# EAGLE design SFT_MainBoard1.0v (EAGLE 7.2.0)
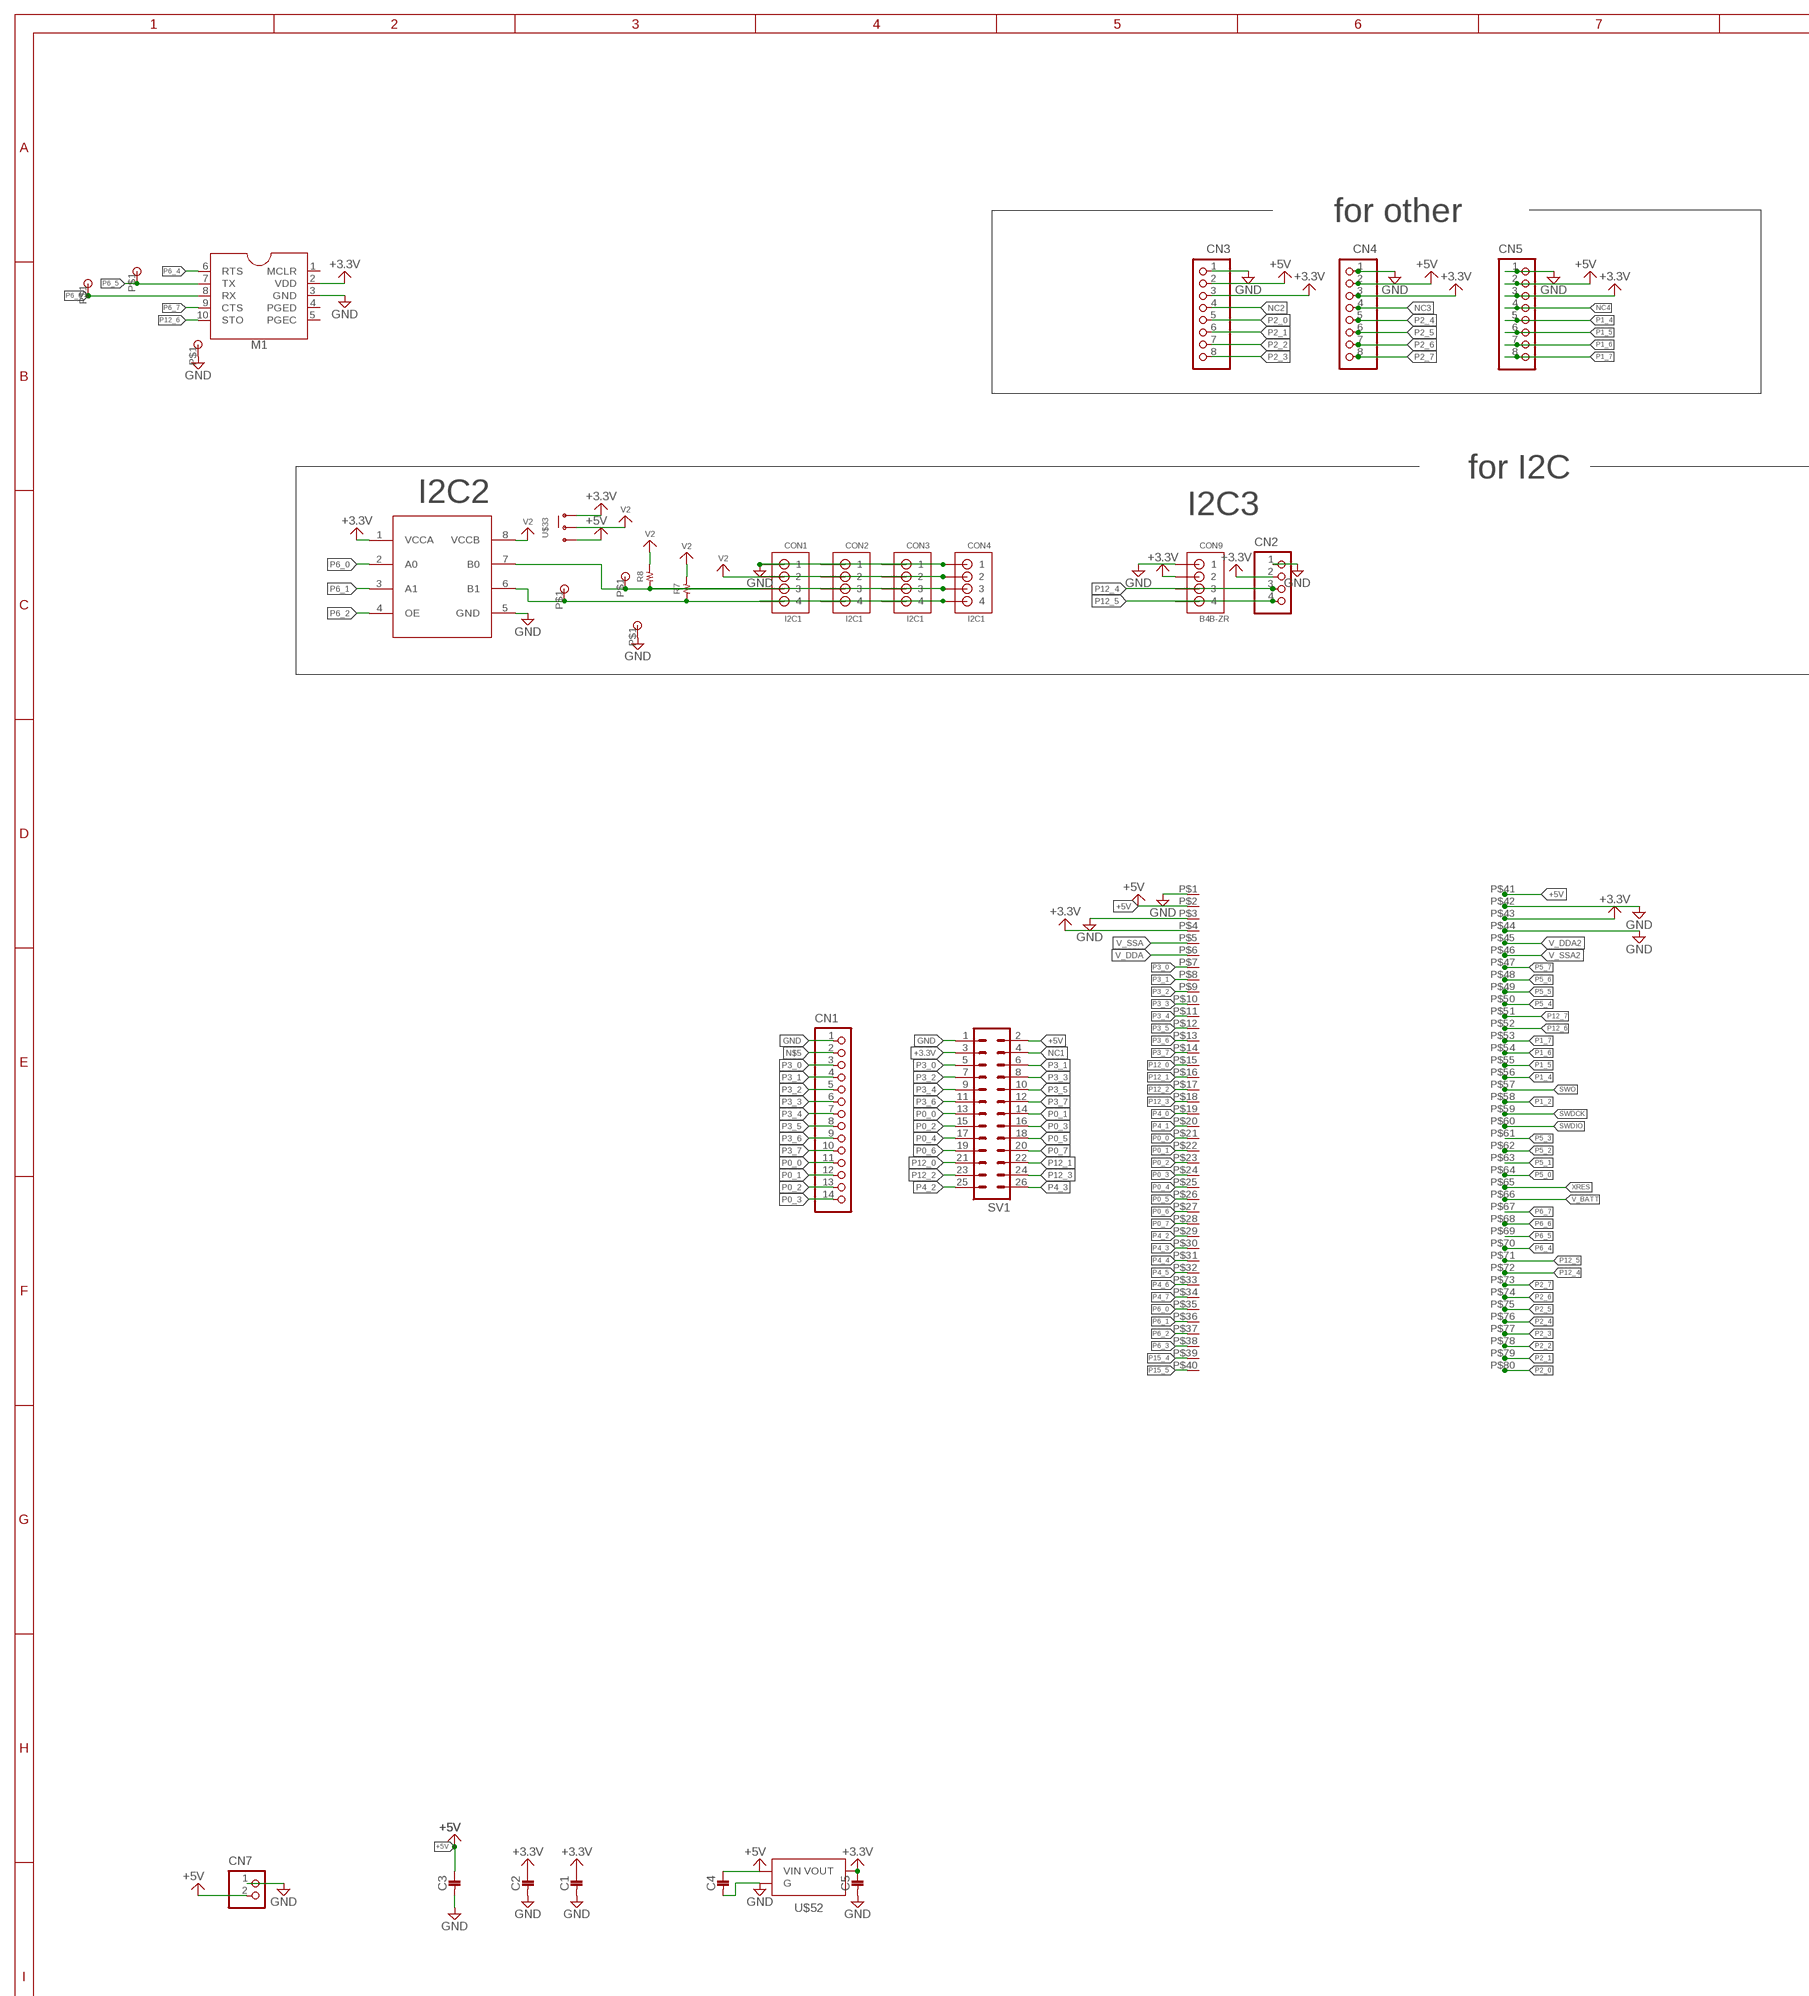
[diagram p0: schematic, sheet 1, part 1 of 2]
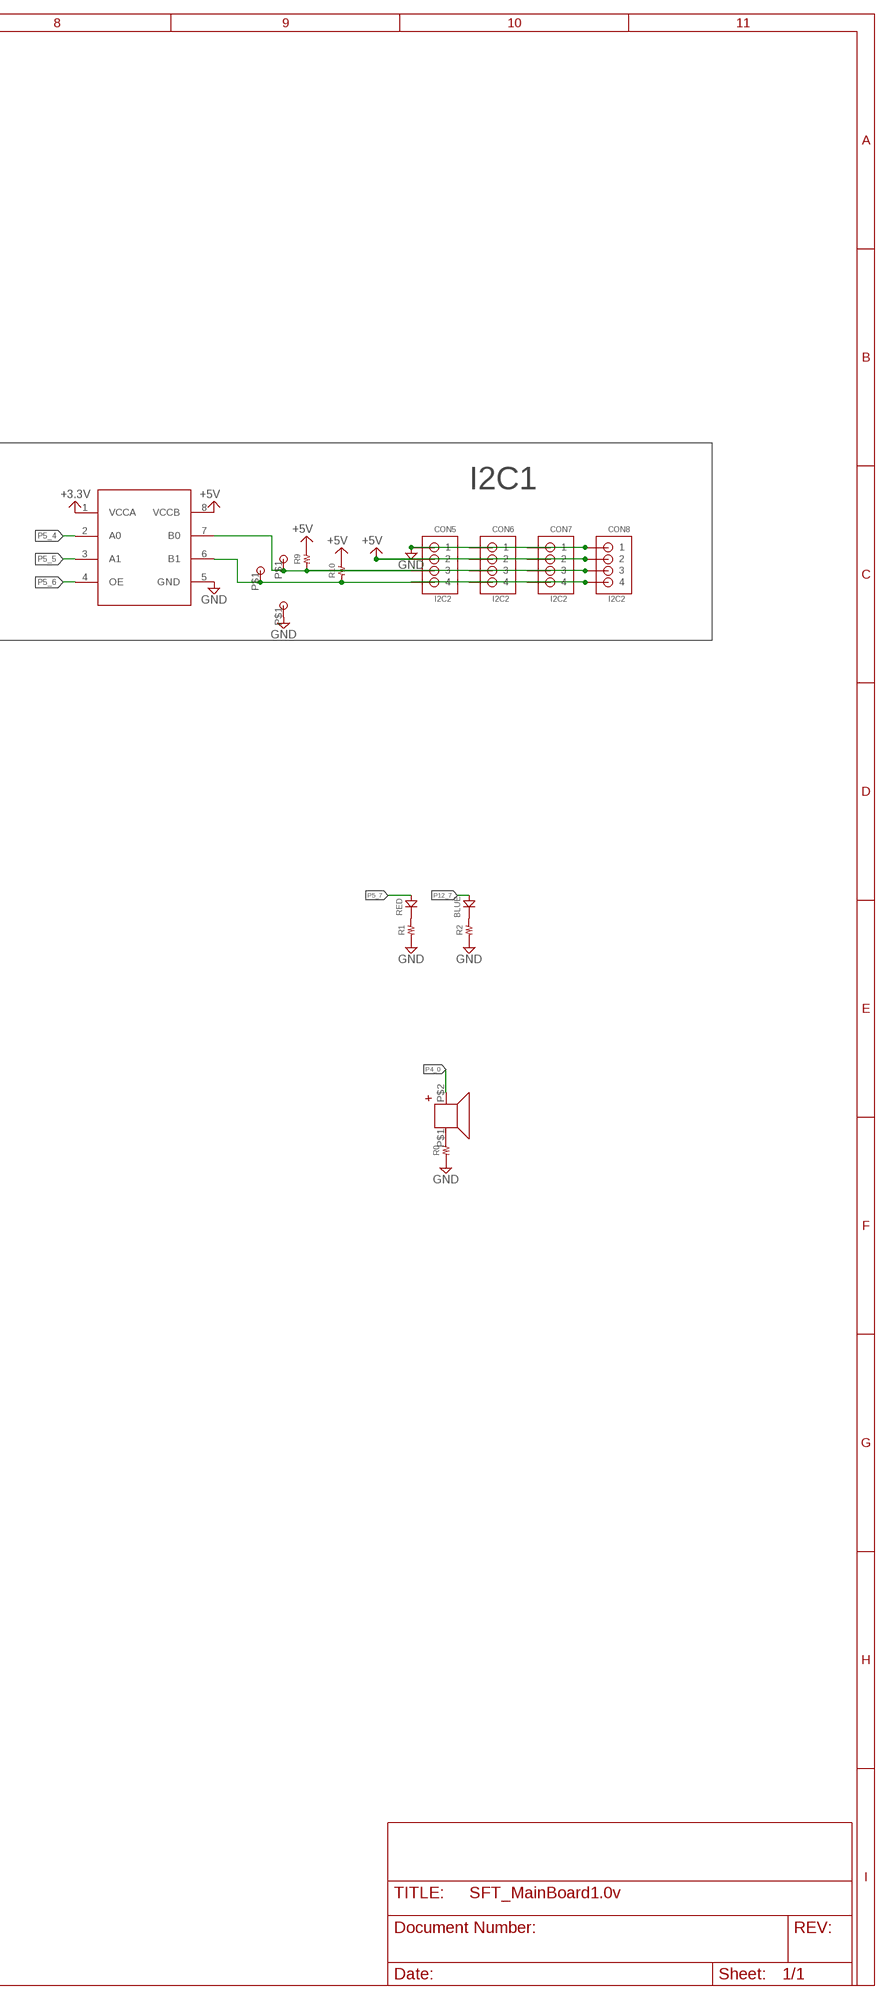
[diagram p1: schematic, sheet 1, part 2 of 2]

## Parts
BLUE  CHIPLED  [1608]
C1  1608  [1608]
C2  1608  [1608]
C3  1608  [1608]
C4  1608  [1608]
C5  1608  [1608]
CN1  B14B-XASK-1  [B14B-XASK-1]
CN2  B4B-PH-K-S  [B4B-PH-K-S]
CN3  B8B-PH-K-S  [B8B-PH-K-S]
CN4  B8B-PH-K-S  [B8B-PH-K-S]
CN5  B8B-PH-K-S  [B8B-PH-K-S]
CN7  B2B-PH-K-S  [B2B-PH-K-S]
CON1  I2C1  B4B-ZR  [B4B-ZR]
CON2  I2C1  B4B-ZR  [B4B-ZR]
CON3  I2C1  B4B-ZR  [B4B-ZR]
CON4  I2C1  B4B-ZR  [B4B-ZR]
CON5  I2C2  B4B-ZR  [B4B-ZR]
CON6  I2C2  B4B-ZR  [B4B-ZR]
CON7  I2C2  B4B-ZR  [B4B-ZR]
CON8  I2C2  B4B-ZR  [B4B-ZR]
CON9  B4B-ZR  [B4B-ZR]
IC1  I2C_FXMA2102  [DIL08]
IC2  I2C_FXMA2102  [DIL08]
M1  SBDBT  [DIL10]
R0  RESISTOR__SMD  [1608]
R1  RESISTOR__SMD  [1608]
R2  RESISTOR__SMD  [1608]
R7  RESISTOR__SMD  [1608]
R8  RESISTOR__SMD  [1608]
R9  RESISTOR__SMD  [1608]
R10  RESISTOR__SMD  [1608]
RED  CHIPLED  [1608]
SP  PKLCS1212E4001  [PKLCS1212E4001]
SV1  ML26  [ML26]
U$2  PSOC_5LP  [PSOC_5LP]
U$15  CHECK_0.8MM  [CHECK_0.8MM]
U$18  CHECK_0.8MM  [CHECK_0.8MM]
U$33  SS12D01G4  [SS12D01G4]
U$37  CHECK_0.8MM  [CHECK_0.8MM]
U$38  CHECK_0.8MM  [CHECK_0.8MM]
U$39  CHECK_0.8MM  [CHECK_0.8MM]
U$52  NJM2845  [TO252]
U$78  CHECK_0.8MM  [CHECK_0.8MM]
U$79  CHECK_0.8MM  [CHECK_0.8MM]
U$82  CHECK_0.8MM  [CHECK_0.8MM]
U$83  CHECK_0.8MM  [CHECK_0.8MM]

## Nets
+3.3V: C1.P$1 C2.P$1 C5.P$1 CN2.2 CN3.3 CN4.3 CN5.3 CON9.2 IC1.1(VCCA) IC2.1(VCCA) M1.2(VDD) SV1.3 U$2.P$4 U$2.P$43 U$33.1 U$52.3(VOUT)
+5V: C3.P$1 C4.P$1 CN3.2 CN4.2 CN5.2 CN7.2 CON5.2 CON6.2 CON7.2 CON8.2 IC1.8(VCCB) R9.2 R10.2 SV1.2 U$2.P$2 U$2.P$41 U$33.3 U$52.1(VIN)
GND: C1.P$2 C2.P$2 C3.P$2 C4.P$2 C5.P$2 CN1.1 CN2.1 CN3.1 CN4.1 CN5.1 CN7.1 CON1.1 CON2.1 CON3.1 CON4.1 CON5.1 CON6.1 CON7.1 CON8.1 CON9.1 IC1.5(GND) IC2.5(GND) M1.3(GND) R0.1 R1.1 R2.1 SV1.1 U$2.P$1 U$2.P$3 U$2.P$42 U$2.P$44 U$37.P$1 U$38.P$1 U$39.P$1 U$52.2(G)
N$1: R0.2 SP.P$1(MINUS)
N$2: R1.2 RED.2(K)
N$3: BLUE.2(K) R2.2
N$5: CN1.2
N$8: CON1.3 CON2.3 CON3.3 CON4.3 IC2.7(B0) R8.1 U$79.P$1
N$9: CON1.4 CON2.4 CON3.4 CON4.4 IC2.6(B1) R7.1 U$78.P$1
N$10: CON5.3 CON6.3 CON7.3 CON8.3 IC1.7(B0) R9.1 U$18.P$1
N$11: CON5.4 CON6.4 CON7.4 CON8.4 IC1.6(B1) R10.1 U$15.P$1
NC1: SV1.4
NC2: CN3.4
NC3: CN4.4
NC4: CN5.4
P0_0: CN1.11 SV1.13 U$2.P$21
P0_1: CN1.12 SV1.14 U$2.P$22
P0_2: CN1.13 SV1.15 U$2.P$23
P0_3: CN1.14 SV1.16 U$2.P$24
P0_4: SV1.17 U$2.P$25
P0_5: SV1.18 U$2.P$26
P0_6: SV1.19 U$2.P$27
P0_7: SV1.20 U$2.P$28
P1_2: U$2.P$58
P1_4: CN5.5 U$2.P$56
P1_5: CN5.6 U$2.P$55
P1_6: CN5.7 U$2.P$54
P1_7: CN5.8 U$2.P$53
P2_0: CN3.5 U$2.P$80
P2_1: CN3.6 U$2.P$79
P2_2: CN3.7 U$2.P$78
P2_3: CN3.8 U$2.P$77
P2_4: CN4.5 U$2.P$76
P2_5: CN4.6 U$2.P$75
P2_6: CN4.7 U$2.P$74
P2_7: CN4.8 U$2.P$73
P3_0: CN1.3 SV1.5 U$2.P$7
P3_1: CN1.4 SV1.6 U$2.P$8
P3_2: CN1.5 SV1.7 U$2.P$9
P3_3: CN1.6 SV1.8 U$2.P$10
P3_4: CN1.7 SV1.9 U$2.P$11
P3_5: CN1.8 SV1.10 U$2.P$12
P3_6: CN1.9 SV1.11 U$2.P$13
P3_7: CN1.10 SV1.12 U$2.P$14
P4_0: SP.P$2(PLUS) U$2.P$19
P4_1: U$2.P$20
P4_2: SV1.25 U$2.P$29
P4_3: SV1.26 U$2.P$30
P4_4: U$2.P$31
P4_5: U$2.P$32
P4_6: U$2.P$33
P4_7: U$2.P$34
P5_0: U$2.P$64
P5_1: U$2.P$63
P5_2: U$2.P$62
P5_3: U$2.P$61
P5_4: IC1.2(A0) U$2.P$50
P5_5: IC1.3(A1) U$2.P$49
P5_6: IC1.4(OE) U$2.P$48
P5_7: RED.1(A) U$2.P$47
P6_0: IC2.2(A0) U$2.P$35
P6_1: IC2.3(A1) U$2.P$36
P6_2: IC2.4(OE) U$2.P$37
P6_3: U$2.P$38
P6_4: M1.6(RTS) U$2.P$70
P6_5: M1.7(TX) U$2.P$69 U$82.P$1
P6_6: M1.8(RX) U$2.P$68 U$83.P$1
P6_7: M1.9(CTS) U$2.P$67
P12_0: SV1.21 U$2.P$15
P12_1: SV1.22 U$2.P$16
P12_2: SV1.23 U$2.P$17
P12_3: SV1.24 U$2.P$18
P12_4: CN2.3 CON9.3 U$2.P$72
P12_5: CN2.4 CON9.4 U$2.P$71
P12_6: M1.10(STO) U$2.P$52
P12_7: BLUE.1(A) U$2.P$51
P15_4: U$2.P$39
P15_5: U$2.P$40
SWDCK: U$2.P$59
SWDIO: U$2.P$60
SWO: U$2.P$57
V2: CON1.2 CON2.2 CON3.2 CON4.2 IC2.8(VCCB) R7.2 R8.2 U$33.2
V_BATT: U$2.P$66
V_DDA: U$2.P$6
V_DDA2: U$2.P$45
V_SSA: U$2.P$5
V_SSA2: U$2.P$46
XRES: U$2.P$65
Unconnected: M1.1(MCLR) M1.4(PGED) M1.5(PGEC)

## Notes on the sheet
- for other
- for I2C
- I2C2
- I2C3 | I2C1

## Library data of the parts
BLUE RED = 10_LED:CHIPLED
C1-C5 = 02_C:1608
CN1 = jst-xa:B14B-XASK-1: Wire-to-Board 2.5mm pitch top mount connector Source: http://www.jst-mfg.com/product/pdf/jpn/XA1.pdf http://www.jst-mfg.com/product/detail.php?series=272
CN2 = jst-ph:B4B-PH-*: Wire-to-Board 2.0mm pitch top mount connector Source: http://www.jst-mfg.com/product/pdf/jpn/PH.pdf http://www.jst-mfg.com/product/detail.php?series=199
CN3-CN5 = jst-ph:B8B-PH-*: Wire-to-Board 2.0mm pitch top mount connector Source: http://www.jst-mfg.com/product/pdf/jpn/PH.pdf http://www.jst-mfg.com/product/detail.php?series=199
CN7 = jst-ph:B2B-PH-*: Wire-to-Board 2.0mm pitch top mount connector Source: http://www.jst-mfg.com/product/pdf/jpn/PH.pdf http://www.jst-mfg.com/product/detail.php?series=199
CON1-CON9 = jst:B4B-ZR: JST-ZH Connector 4 pol, 1.5mm pitch Package: B4B-ZR Source: http://www.jst-mfg.com/product/pdf/eng/eZH.pdf
IC1 IC2 = 04_IC:I2C_FXMA2102
M1 = 12_module:SBDBT
R0 R1 R2 R7-R10 = 01_R:RESISTOR__SMD
SP = 13_SPEAKER:PKLCS1212E4001
SV1 = con-ml:ML26: HARTING; OC_FARNELL: unknown; OC_NEWARK: unknown
U$2 = 12_module:PSOC_5LP
U$15 U$18 U$37-U$39 U$78 U$79 U$82 U$83 = 08_CONECTOR:CHECK_0.8MM
U$33 = 09_1_switch:SS12D01G4
U$52 = 04_IC:NJM2845

## Net classes
0 default: width 0.3 mm

## Board
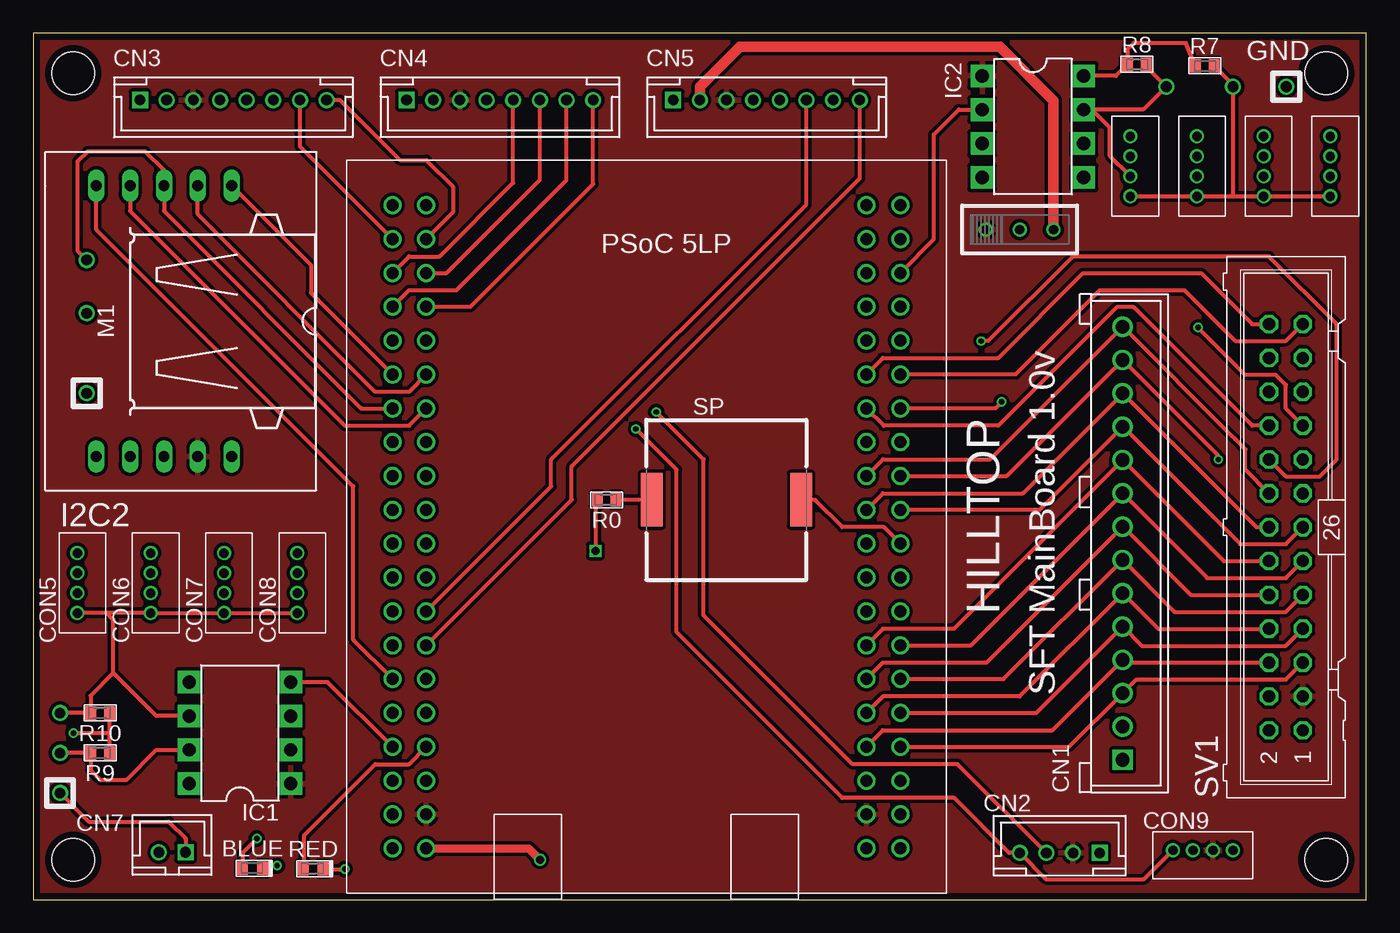
[diagram p2: board, top side]
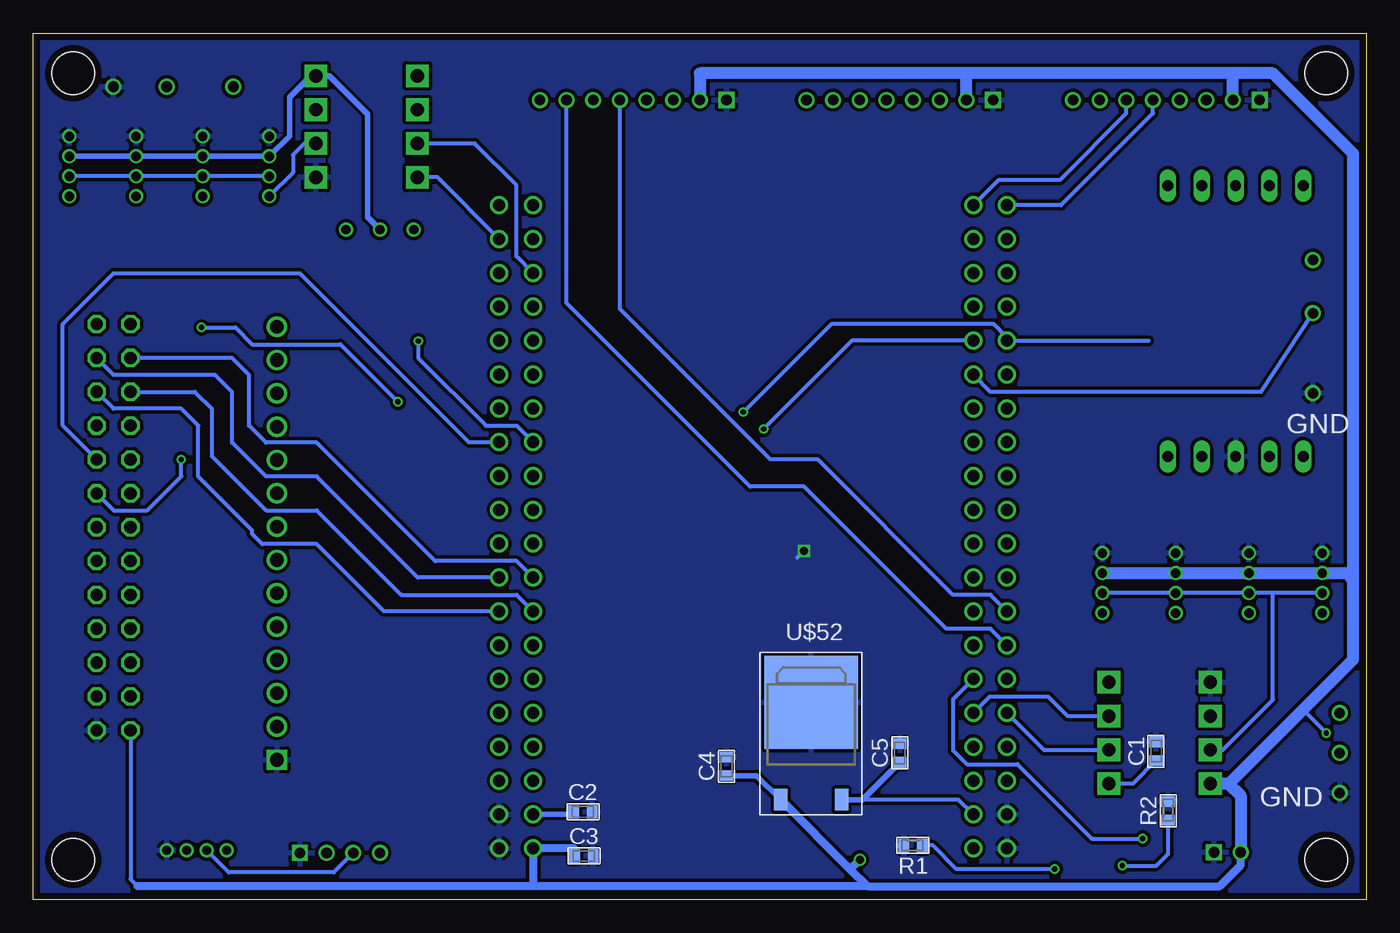
[diagram p3: board, bottom side, seen from below]

Size 100 x 65 mm. Coordinates in mm from the lower left corner, seen from the top.
Outline: 0,0 100,0 100,65 0,65 0,0
Copper layers (1+2*15+16): Top 0.018mm / dielectric 0.25mm / layer 2 0.035mm / dielectric 1mm / layer 15 0.035mm / dielectric 0.25mm / Bottom 0.018mm
Design rules "pban_5mil-l4 *": minimum track width 5mil, minimum drill 0.3mm, track to track 5mil, track to pad 0.229mm, pad to pad 5mil, via to via 5mil, smd to smd 5mil, copper to edge 0.5mm, drill to drill 0.5mm, minimum pad ring 0.15mm, minimum via ring 0.15mm, stop-mask expansion 4mil, vias tented up to drill 0.5mm, thermal gap 10mil
Holes 3.2 mm at 3,3 3,62 97,3 97,62
tKeepout: area 0,0 to 6,6; area 94,0 to 100,6; area 94,59 to 100,65; area 0,59 to 6,65

### Footprints (pad centres in the part's own frame; a part is rotated, then mirrored left to right if it is on the bottom)
1608 = smd 0.8 x 1: 1 -0.75,0; 2 0.75,0
1608' = smd 0.8 x 1: P$1 -0.7,0; P$2 0.7,0
B14B-XASK-1 = drill 1.016 square: 1 -16.25,0 | drill 1.016: 2 -13.75,0; 3 -11.25,0; 4 -8.75,0; 5 -6.25,0; 6 -3.75,0; 7 -1.25,0; 8 1.25,0; 9 3.75,0; 10 6.25,0; 11 8.75,0; 12 11.25,0; 13 13.75,0; 14 16.25,0
B4B-PH-K-S = drill 0.8 square: 1 -3,0 | drill 0.8: 2 -1,0; 3 1,0; 4 3,0
B8B-PH-K-S = drill 0.8 square: 1 -7,0 | drill 0.8: 2 -5,0; 3 -3,0; 4 -1,0; 5 1,0; 6 3,0; 7 5,0; 8 7,0
B2B-PH-K-S = drill 0.8 square: 1 -1,0 | drill 0.8: 2 1,0
B4B-ZR = drill 0.7: 1 6,-1.3; 2 4.5,-1.3; 3 3,-1.3; 4 1.5,-1.3
DIL08 = drill 1 pad 1.7 square: 1 -3.81,-3.81; 2 -1.27,-3.81; 3 1.27,-3.81; 4 3.81,-3.81; 5 3.81,3.81; 6 1.27,3.81; 7 -1.27,3.81; 8 -3.81,3.81
DIL10 = drill 0.813 long: 1 10.16,5.08; 2 10.16,2.54; 3 10.16,0; 4 10.16,-2.54; 5 10.16,-5.08; 6 -10.16,5.08; 7 -10.16,2.54; 8 -10.16,0; 9 -10.16,-2.54; 10 -10.16,-5.08
1608'' = smd 0.8 x 1: 1 -0.7,0; 2 0.7,0
PKLCS1212E4001 = smd 1.6 x 4: P$1 -5.6,0; P$2 5.6,0
ML26 = drill 0.914 octagon: 1 -15.24,-1.27; 2 -15.24,1.27; 3 -12.7,-1.27; 4 -12.7,1.27; 5 -10.16,-1.27; 6 -10.16,1.27; 7 -7.62,-1.27; 8 -7.62,1.27; 9 -5.08,-1.27; 10 -5.08,1.27; 11 -2.54,-1.27; 12 -2.54,1.27; 13 0,-1.27; 14 0,1.27; 15 2.54,-1.27; 16 2.54,1.27; 17 5.08,-1.27; 18 5.08,1.27; 19 7.62,-1.27; 20 7.62,1.27; 21 10.16,-1.27; 22 10.16,1.27; 23 12.7,-1.27; 24 12.7,1.27; 25 15.24,-1.27; 26 15.24,1.27
PSOC_5LP = drill 0.9: P$1 -19.05,24.13; P$2 -16.51,24.13; P$3 -19.05,21.59; P$4 -16.51,21.59; P$5 -19.05,19.05; P$6 -16.51,19.05; P$7 -19.05,16.51; P$8 -16.51,16.51; P$9 -19.05,13.97; P$10 -16.51,13.97; P$11 -19.05,11.43; P$12 -16.51,11.43; P$13 -19.05,8.89; P$14 -16.51,8.89; P$15 -19.05,6.35; P$16 -16.51,6.35; P$17 -19.05,3.81; P$18 -16.51,3.81; P$19 -19.05,1.27; P$20 -16.51,1.27; P$21 -19.05,-1.27; P$22 -16.51,-1.27; P$23 -19.05,-3.81; P$24 -16.51,-3.81; P$25 -19.05,-6.35; P$26 -16.51,-6.35; P$27 -19.05,-8.89; P$28 -16.51,-8.89; P$29 -19.05,-11.43; P$30 -16.51,-11.43; P$31 -19.05,-13.97; P$32 -16.51,-13.97; P$33 -19.05,-16.51; P$34 -16.51,-16.51; P$35 -19.05,-19.05; P$36 -16.51,-19.05; P$37 -19.05,-21.59; P$38 -16.51,-21.59; P$39 -19.05,-24.13; P$40 -16.51,-24.13; P$41 16.51,24.13; P$42 19.05,24.13; P$43 16.51,21.59; P$44 19.05,21.59; P$45 16.51,19.05; P$46 19.05,19.05; P$47 16.51,16.51; P$48 19.05,16.51; P$49 16.51,13.97; P$50 19.05,13.97; P$51 16.51,11.43; P$52 19.05,11.43; P$53 16.51,8.89; P$54 19.05,8.89; P$55 16.51,6.35; P$56 19.05,6.35; P$57 16.51,3.81; P$58 19.05,3.81; P$59 16.51,1.27; P$60 19.05,1.27; P$61 16.51,-1.27; P$62 19.05,-1.27; P$63 16.51,-3.81; P$64 19.05,-3.81; P$65 16.51,-6.35; P$66 19.05,-6.35; P$67 16.51,-8.89; P$68 19.05,-8.89; P$69 16.51,-11.43; P$70 19.05,-11.43; P$71 16.51,-13.97; P$72 19.05,-13.97; P$73 16.51,-16.51; P$74 19.05,-16.51; P$75 16.51,-19.05; P$76 19.05,-19.05; P$77 16.51,-21.59; P$78 19.05,-21.59; P$79 16.51,-24.13; P$80 19.05,-24.13
CHECK_0.8MM = drill 0.8: P$1 0,0
SS12D01G4 = drill 0.7: 1 -2.54,0; 2 0,0; 3 2.54,0
TO252 = smd 1 x 1.6: 1 -2.52,-6.22; 3 2.04,-6.22 | smd 7 x 7: 2 -0.24,1.08

### Placement (x,y rotation side)
BLUE  16.45,2.35 0 top
C1  [1608']  15.77,11.13 90 bottom
C2  [1608']  58.77,6.58 0 bottom
C3  [1608']  58.7,3.27 0 bottom
C4  [1608']  48,10 90 bottom
C5  [1608']  35,11 90 bottom
CN1  81.73,26.73 90 top
CN2  77,3.5 180 top
CN3  15,60 0 top
CN4  35,60 0 top
CN5  55,60 0 top
CN7  10.42,3.55 180 top
CON1  96,51.27 90 top
CON2  91,51.27 90 top
CON3  86,51.27 90 top
CON4  81,51.27 90 top
CON5  2,20 90 top
CON6  7.5,20 90 top
CON7  13,20 90 top
CON8  18.5,20 90 top
CON9  84,5 0 top
DRILEGEND  [DRILEGEND]  27.8,-29.21 0 top  (outside the outline)
IC1  15.5,12.5 90 top
IC2  75,58 270 top
M1  9.8,43.4 270 top
R0  [1608'']  43,30 0 top
R1  [1608'']  33.99,4.05 0 bottom
R2  [1608'']  14.86,6.65 270 bottom
R7  [1608'']  87.88,62.57 180 top
R8  [1608'']  82.78,62.66 180 top
R9  [1608'']  5,11 0 top
R10  [1608'']  5,14 0 top
RED  20.99,2.31 0 top
SP  52,30 0 top
SV1  93.98,27.94 90 top
U$2  45.99,27.97 180 top
U$15  2,14 0 top
U$18  2,11 0 top
U$33  74,50.27 0 top
U$37  2,8 0 top
U$38  4,38 0 top
U$39  94,61 0 top
U$52  41.4,13.72 0 bottom
U$78  90,61 0 top
U$79  85,61 0 top
U$82  4,44 0 top
U$83  4,48 0 top

### Tracks (layer width: path | path; a pad name or v marks a point on that pad's centre or on a via)
+3.3V
  Bottom 0.3: U$2.P$43 30.59,7.5 U$52.3 | C1.P$1 17.5,8.69 IC1.1
  Bottom 0.4: C2.P$1 59.67,6.38 U$2.P$4
  Bottom 0.406: C5.P$1 37.8,7.5 U$52.3
  pour Top (isolate 0.254): 0,65 100,65 100,0 0,0
+5V  (via drill 0.4, 0.6)
  Top 0.3: R10.2 5.7,12.5 | 5.7,12.5 R9.2 | v3,12.5 5.7,12.5
  Top 0.6: U$2.P$41 37.16,3.84 v38,3
  Top 0.8: CN5.2 50,61 53,64 72.5,64 76.54,59.96 U$33.3
  Bottom 0.3: v3,12.5 4.5,14 5,14 | SV1.2 92.71,1.52 92.19,1
  Bottom 0.406: C4.P$1 45.73,9.3 U$52.1
  Bottom 0.6: U$52.1 38.71,2.29 | 38.71,2.29 37.43,1 | 37.43,1 11,1 9.42,2.58 CN7.2 | 37.43,1 62.5,1 | 62.5,1 U$2.P$2 59.4,3.84 C3.P$1 | 62.5,1 92.19,1 | v38,3 38.71,2.29
  Bottom 0.9: CON8.2 CON7.2 CON6.2 CON5.2 1.5,24.5 1,24 | 1,24 1,18 5,14 10.31,8.69 | 10.31,8.69 IC1.8 | 10.31,8.69 9.42,7.8 CN7.2 | 1,24 1,56 7,62 10,62 | CN3.2 10,62 | 10,62 30,62 | 30,62 50,62 CN5.2 | CN4.2 30,62
GND  (via drill 0.6)
  Top 0.3: R0.1 42.16,29.86 v42.16,26.16 | U$37.P$1 4.16,5.84 10.16,5.84 11.42,4.58 CN7.1
  Bottom 0.3: v42.16,26.16 42.67,25.65
  pour Bottom (isolate 0.254): 0,65 100,65 100,0 0,0
N$1
  Top 0.3: SP.P$1 R0.2
N$2  (via drill 0.4)
  Top 0.3: RED.2 21.76,2.29 v23.37,2.29
  Bottom 0.3: v23.37,2.29 30.73,2.29 32.5,4.05 R1.2
N$3  (via drill 0.4)
  Top 0.3: BLUE.2 17.39,2.54 v18.29,2.54
  Bottom 0.3: v18.29,2.54 15.75,2.54 14.86,3.43 R2.2
N$8
  Top 0.3: CON4.3 80.77,55.8 80.77,57.91 79.41,59.27 | 79.41,59.27 IC2.7 | 79.41,59.27 83.27,59.27 U$79.P$1 83.48,62.52 R8.1
  Bottom 0.3: CON4.3 CON3.3 CON2.3 CON1.3
N$9
  Top 0.3: CON4.4 CON3.4 90,52.77 | 90,52.77 CON2.4 CON1.4 | R7.1 90,61.14 U$78.P$1 90,52.77
  Bottom 0.3: IC2.6 79.67,56.73 80.52,55.88 80.52,54.55 CON4.4
N$10
  Top 0.3: U$18.P$1 R9.1 4.3,9.7 5,9 7,9 9.23,11.23 IC1.7
  Bottom 0.3: IC1.7 10.77,11.23 7,15 7,23 CON6.3 | CON5.3 CON6.3 | CON6.3 CON7.3 CON8.3
N$11
  Top 0.3: IC1.6 9.23,13.77 6,17 | 6,17 6,21 5.5,21.5 | 5.5,21.5 CON5.4 | 5.5,21.5 CON6.4 CON7.4 CON8.4 | 6,17 4.3,15.3 R10.1 U$15.P$1
P0_0
  Top 0.3: U$2.P$21 75.49,29.24 CN1.11 90.54,26.67 93.98,26.67 SV1.13
P0_1
  Top 0.3: U$2.P$22 63.74,30.48 74.23,30.48 CN1.12 91.77,27.94 SV1.14
P0_2  (via drill 0.4)
  Top 0.3: U$2.P$23 73.03,31.78 CN1.13 88.9,33.31 v88.9,33.02
  Bottom 0.3: SV1.15 93.98,29.21 91.44,29.21 88.9,31.75 v88.9,33.02
P0_3
  Top 0.3: U$2.P$24 63.74,33.02 71.77,33.02 CN1.14 89.91,34.8 90.17,34.54 90.93,33.78 90.93,32.26 SV1.16
P0_4
  Bottom 0.3: SV1.17 97.79,35.56 97.79,43.18 93.98,46.99 80.01,46.99 67.34,34.32 U$2.P$25
P0_5  (via drill 0.4)
  Top 0.3: SV1.18 93.98,31.75 96.52,31.75 97.79,33.02 97.79,43.18 92.71,48.26 77.98,48.26 71.63,41.91 v71.12,41.91
  Bottom 0.3: v71.12,41.91 71.12,40.64 66.04,35.56 63.74,35.56 U$2.P$26
P0_6  (via drill 0.4)
  Top 0.3: SV1.19 93.98,36.83 93.98,38.61 93.22,39.37 90.93,39.37 v87.38,42.93 | v72.64,37.34 72.17,36.86 U$2.P$27
  Bottom 0.3: v87.38,42.93 84.84,42.93 83.57,41.66 76.96,41.66 v72.64,37.34
P0_7
  Top 0.3: SV1.20 91.44,35.56 82.55,44.45 81.28,44.45 72.39,35.56 63.8,35.56 U$2.P$28
P1_4
  Bottom 0.3: U$2.P$56 28.18,22.86 30.99,22.86 41.15,33.02 44.7,33.02 56,44.32 CN5.5
P1_5
  Top 0.3: U$2.P$55 38.86,31 38.86,33.02 58,52.16 CN5.6
P1_6
  Bottom 0.3: U$2.P$54 28.18,20.32 31.5,20.32 42.16,30.99 46.23,30.99 60,44.76 CN5.7
P1_7
  Top 0.3: CN5.8 62,54.13 40.39,32.51 40.39,29.99 U$2.P$53
P2_0
  Bottom 0.3: U$2.P$80 22.9,52.1 16,59 CN3.5
P2_1
  Bottom 0.3: U$2.P$79 27.58,54 23,54 18,59 CN3.6
P2_2
  Top 0.3: U$2.P$78 20,56.5 CN3.7
P2_3
  Top 0.3: U$2.P$77 31.49,51.57 31.49,53.48 29.48,55.49 27.51,55.49 23,60 CN3.8
P2_4
  Top 0.3: U$2.P$76 28.18,48.26 30.48,48.26 36,53.78 CN4.5
P2_5
  Top 0.3: U$2.P$75 31.02,47.02 38,54 CN4.6
P2_6
  Top 0.3: U$2.P$74 28.18,45.72 31.75,45.72 40,53.97 CN4.7
P2_7
  Top 0.3: U$2.P$73 32.8,44.48 42,53.68 CN4.8
P3_0
  Top 0.3: U$2.P$7 77.71,11.46 CN1.3 82.76,16.51 93.98,16.51 SV1.5
P3_1
  Top 0.3: U$2.P$8 63.74,12.7 76.45,12.7 CN1.4 81.93,17.78 SV1.6
P3_2
  Top 0.3: U$2.P$9 75.25,14 CN1.5 83.16,19.05 93.98,19.05 SV1.7
P3_3
  Top 0.3: SV1.8 84.39,20.32 CN1.6 73.99,15.24 63.74,15.24 U$2.P$10
P3_4
  Top 0.3: U$2.P$11 72.79,16.54 CN1.7 85.62,21.59 93.98,21.59 SV1.9
P3_5
  Top 0.3: U$2.P$12 63.74,17.78 71.53,17.78 CN1.8 86.85,22.86 SV1.10
P3_6
  Top 0.3: U$2.P$13 70.33,19.08 CN1.9 88.08,24.13 93.98,24.13 SV1.11
P3_7
  Top 0.3: U$2.P$14 63.74,20.32 69.07,20.32 CN1.10 89.31,25.4 SV1.12
P4_0
  Top 0.3: U$2.P$19 63.8,27.94 60.71,27.94 58.65,30 SP.P$2
P4_2
  Top 0.3: SV1.25 93.98,41.91 90.17,41.91 86.36,45.72 80.01,45.72 73.69,39.4 U$2.P$29
P4_3
  Top 0.3: U$2.P$30 63.74,40.64 72.39,40.64 78.74,46.99 87.63,46.99 91.44,43.18 SV1.26
P5_4
  Bottom 0.3: U$2.P$50 24.17,11.23 IC1.2
P5_5
  Bottom 0.3: U$2.P$49 28.24,15.24 23.88,15.24 22.41,13.77 IC1.3
P5_6
  Top 0.3: U$2.P$48 22.09,16.31 IC1.4
P5_7
  Top 0.3: RED.1 20.32,2.39 20.32,4.83 25.65,10.16 28.18,10.16 U$2.P$47
P6_0
  Top 0.3: U$2.P$35 67.56,49.55 67.56,57.4 69.43,59.27 IC2.2
P6_1
  Bottom 0.3: U$2.P$36 63.75,48.28 63.75,53.59 66.89,56.73 IC2.3
P6_2
  Bottom 0.3: U$2.P$37 69.67,54.19 IC2.4
P6_4
  Top 0.3: M1.6 20.83,47.61 20.83,45.51 U$2.P$70
P6_5
  Top 0.3: U$2.P$69 28.18,38.1 25.65,38.1 12.34,51.41 M1.7
  Bottom 0.3: U$82.P$1 7.9,38.1 28.18,38.1 U$2.P$69
P6_6
  Top 0.3: U$2.P$68 24.61,36.86 9.8,51.67 M1.8 9.8,54.72 8.38,56.13 4.06,56.13 3.3,55.37 3.3,48.7 U$83.P$1
P6_7
  Top 0.3: M1.9 7.26,51.67 23.37,35.56 28.19,35.56 28.19,35.58 U$2.P$67
P12_0
  Bottom 0.3: U$2.P$15 73.69,21.62 78.74,26.67 82.82,26.67 83.59,27.44 83.59,27.71 87.63,31.75 87.63,35.56 88.9,36.83 93.98,36.83 SV1.21
P12_1
  Bottom 0.3: SV1.22 87.88,38.1 86.61,36.83 86.61,33.27 82.55,29.21 78.74,29.21 72.39,22.86 63.74,22.86 U$2.P$16
P12_2
  Bottom 0.3: U$2.P$17 71.15,24.16 78.74,31.75 82.55,31.75 85.09,34.29 85.09,38.1 86.36,39.37 93.98,39.37 SV1.23
P12_3
  Bottom 0.3: U$2.P$18 63.74,25.4 69.85,25.4 78.74,34.29 82.55,34.29 83.82,35.56 83.82,39.37 85.09,40.64 SV1.24
P12_4  (via drill 0.4)
  Top 0.3: CN2.3 69.34,10.16 61.47,10.16 50.29,21.34 50.29,33.02 v46.74,36.58
  Bottom 0.3: 16.34,41.94 U$2.P$72 26.94,42.18 27.94,43.18 40.13,43.18 v46.74,36.58 | CN2.3 77.47,2.03 85.33,2.03 CON9.3
P12_5  (via drill 0.4)
  Top 0.3: v45.21,35.31 48.26,32.26 48.26,20.07 60.71,7.62 69.09,7.62 73.21,3.5 CN2.4 75.98,1.52 83.32,1.52 CON9.4
  Bottom 0.3: 29.51,41.91 U$2.P$71 38.58,41.94 v45.21,35.31
P12_6
  Top 0.3: U$2.P$52 24,19.48 24,31 4.72,50.28 M1.10
P12_7  (via drill 0.4)
  Top 0.3: v16.76,4.57 15.7,3.51 BLUE.1
  Bottom 0.3: U$2.P$51 30.99,15.03 30.99,11.18 29.97,10.16 26.16,10.16 20.57,4.57 v16.76,4.57
V2
  Top 0.3: R7.2 86.48,64.26 82.55,64.26 82.08,63.79 R8.2 81.23,61.81 IC2.8
  Bottom 0.4: CON1.2 CON2.2 CON3.2 CON4.2 80.77,57.3 80.77,60.2 79.16,61.81 IC2.8 77.81,61.81 74.93,58.93 74.93,51.2 U$33.2

### Text on the board
tPlace: GND | PSoC 5LP | HILLTOP | I2C2 | SFT MainBoard 1.0v
bPlace: GND | GND
DrillLegend_01-20: 穴図